# Altium schematic sheet NNLightSwitcher_WirelessCharger.SchDoc
size A4
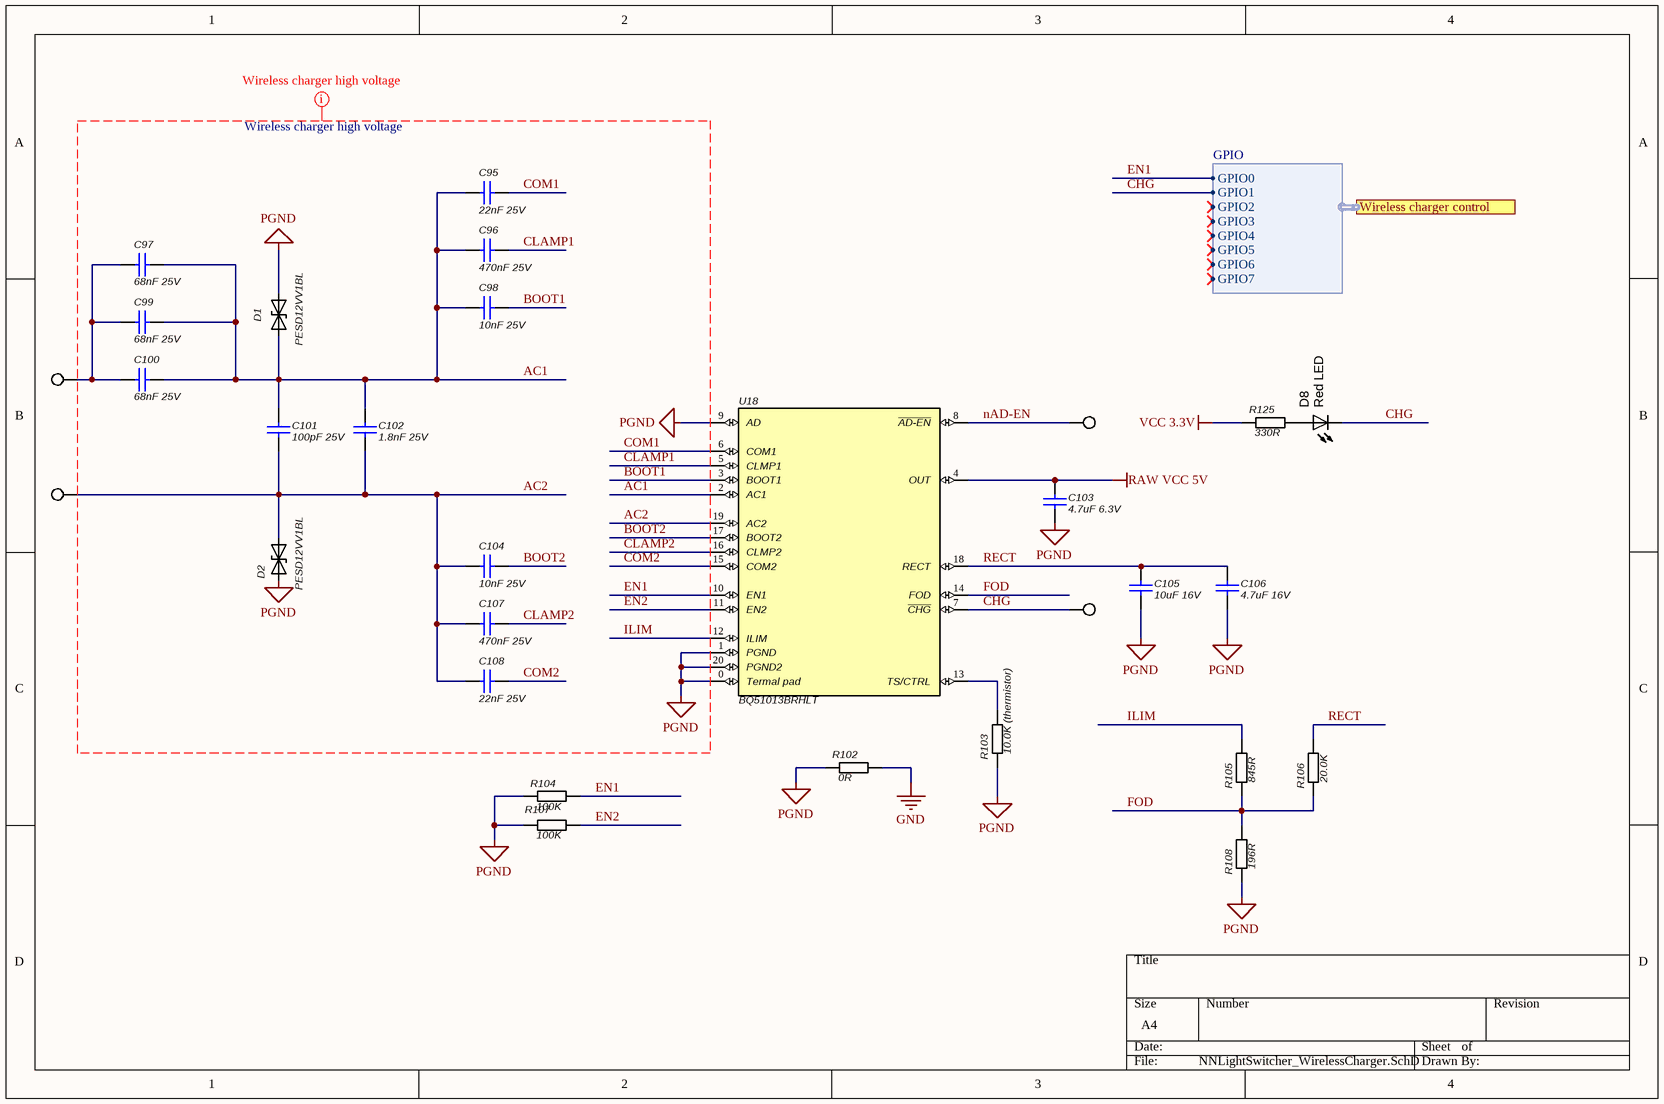
[diagram p0: NNLightSwitcher_WirelessCharger.SchDoc]

## Parts
C95  22nF 25V  [0402]
C96  470nF 25V  [0402]
C97  68nF 25V  [*0603]
C98  10nF 25V  [0402]
C99  68nF 25V  [*0603]
C100  68nF 25V  [*0603]
C101  100pF 25V  [0402]
C102  1.8nF 25V  [0402]
C103  4.7uF 6.3V  [*0603]
C104  10nF 25V  [0402]
C105  10uF 16V  [*0603]
C106  4.7uF 16V  [*0603]
C107  470nF 25V  [0402]
C108  22nF 25V  [0402]
D1  PESD12VV1BL  [*SOD882(T)]
D2  PESD12VV1BL  [*SOD882(T)]
D8  Red LED  [*LED_SML-P11UTT86R_SML-P11MTT86(Primary)]
R102  0R  [0402]
R103  10.0K (thermistor)  [0402]
R104  100K  [0402]
R105  845R  [0402]
R106  20.0K  [0402]
R107  100K  [0402]
R108  196R  [0402]
R125  330R  [0402]
TP56  Test point  [Connection]  (value not drawn)
TP57  Test point  [Testpoint_with_pad]  (value not drawn)
TP58  Test point  [Connection]  (value not drawn)
TP59  Test point  [Testpoint_Keystone_Miniature]  (value not drawn)
U18  BQ51013BRHLT  [*QFN-20(VQFN-20)]

## Ports
Wireless charger control (harness GPIO)

## Harnesses
GPIO: GPIO7, GPIO6, GPIO5, GPIO4, GPIO3, GPIO2, GPIO1, GPIO0

## Nets
GND: R102.2
PGND: C103.2 C105.1 C106.2 D1.1(K) D2.2(A) R102.1 R103.1 R104.1 R107.1 R108.1 U18.0(Termal_pad) U18.1(PGND) U18.9(AD) U18.20(PGND2)
RAW VCC 5V: C103.1 U18.4(OUT)
VCC 3.3V: R125.1
AC1: C95.2 C96.2 C97.1 C98.2 C99.1 C100.1 C101.1 C102.1 D1.2(A) U18.2(AC1)
AC2: C101.2 C102.2 C104.2 C107.2 C108.2 D2.1(K) TP58.1 U18.19(AC2)
BOOT1: C98.1 U18.3(BOOT1)
BOOT2: C104.1 U18.17(BOOT2)
CHG: D8.C TP59.1 U18.7(~{CHG}) ; port Wireless charger control.GPIO1
CLAMP1: C96.1 U18.5(CLMP1)
CLAMP2: C107.1 U18.16(CLMP2)
COM1: C95.1 U18.6(COM1)
COM2: C108.1 U18.15(COM2)
EN1: R104.2 U18.10(EN1) ; port Wireless charger control.GPIO0
EN2: R107.2 U18.11(EN2)
FOD: R105.1 R106.1 R108.2 U18.14(FOD)
ILIM: R105.2 U18.12(ILIM)
nAD-EN: TP57.1 U18.8(~{AD-EN})
RECT: C105.2 C106.1 R106.2 U18.18(RECT)
NetC97_2: C97.2 C99.2 C100.2 TP56.1
NetD8_A: D8.A R125.2
NetR103_2: R103.2 U18.13(TS/CTRL)

## Layout directives
net class Wireless charger high voltage: AC1, AC2, BOOT1, BOOT2, CLAMP1, CLAMP2, COM1, COM2, EN1, EN2, ILIM, PGND

## Library data of the parts
C95 C108 = Capacitor 22nF 25V: GRM155R71E223KA61D; Manufacturer 1: Murata; Tolerance: 10%; Dielectric: X7R; ComponentLink1Description: Datasheet link; ComponentLink1URL: http://www.yageo.com/documents/recent/UPY-GP_NP0_16V-to-50V_16.pdf; Supplier 1: Digi-Key; Manufacturer Part Number 1: GRM155R71E223KA61D; Stock 1: 876310; Pricing 1: 1=0,10000, 10=0,05300, 100=0,02370, 500=0,01690, 1000=0,01328, 2500=0,01208, 5000=0,01111 (USD); RoHS: Yes; Mount: Surface Mount; Case/Package: 0402; Case Code (Metric): 1005; Case Code (Imperial): 0402; Min Operating Temperature: -55°C; Max Operating Temperature: 125°C; Capacitance: 22nF; Packaging: Tape and Reel; Package Quantity: 1; Voltage Rating: 25V; Termination: SMD/SMT; Voltage: 25V; Voltage Rating (DC): 25V; Length: 1mm; Height: 0.5mm; Width: 0.02inch; Thickness: 0.022inch; Depth: 0.5mm; Radiation Hardening: No; REACH SVHC: No SVHC; Lead Free: Lead Free; ComponentLink2URL: https://datasheet.ciiva.com/131/product-131108.pdf?src-supplier=Digi-Key; ComponentLink2Description: https://datasheet.ciiva.com/131/product-131108.pdf?src-supplier=Digi-Key; ComponentLink3URL: https://datasheet.ciiva.com/131/grm155r71e223ka61-01-131110.pdf?src-supplier=Digi-Key; ComponentLink3Description: https://datasheet.ciiva.com/131/grm155r71e223ka61-01-131110.pdf?src-supplier=Digi-Key; ComponentLink4URL: https://datasheet.ciiva.com/18184/getdatasheetpartid-178879-18184701.pdf?src-supplier=Verical; ComponentLink4Description: https://datasheet.ciiva.com/18184/getdatasheetpartid-178879-18184701.pdf?src-supplier=Verical; ComponentLink5URL: https://datasheet.ciiva.com/14103/grmseries-highdielectrictype-eng-14103752.pdf?src-supplier=Distrelec; ComponentLink5Description: https://datasheet.ciiva.com/14103/grmseries-highdielectrictype-eng-14103752.pdf?src-supplier=Distrelec; ComponentLink6URL: https://datasheet.ciiva.com/5414/product-5414091.pdf?src-supplier=Mouser; ComponentLink6Description: https://datasheet.ciiva.com/5414/product-5414091.pdf?src-supplier=Mouser; ComponentLink7URL: https://datasheet.ciiva.com/16396/product-16396813.pdf?src-supplier=Future+Electronics; ComponentLink7Description: https://datasheet.ciiva.com/16396/product-16396813.pdf?src-supplier=Future+Electronics; ComponentLink8URL: https://datasheet.ciiva.com/2989/product-2989390.pdf?src-supplier=Avnet; ComponentLink8Description: https://datasheet.ciiva.com/2989/product-2989390.pdf?src-supplier=Avnet
C96 C107 = Capacitor 470nF 25V: GRM188R71E474KA12D; Manufacturer 1: Murata; Material: Ceramic; Tolerance: 10%; Dielectric: X7R; Voltage: 50V; ComponentLink1Description: Datasheet link; ComponentLink1URL: http://www.yageo.com/documents/recent/UPY-GP_NP0_16V-to-50V_16.pdf; Supplier 1: Digi-Key; Manufacturer Part Number 1: GRM188R71E474KA12D; Stock 1: 3228065; Pricing 1: 1=0,25000, 10=0,16800, 100=0,08520, 500=0,05832, 1000=0,05159 (USD); RoHS: Yes; Mount: Surface Mount; Case/Package: 0603; Number of Pins: 2; Case Code (Metric): 1608; Case Code (Imperial): 0603; Min Operating Temperature: -55°C; Max Operating Temperature: 125°C; Capacitance: 470nF; Packaging: Tape and Reel; Voltage Rating: 25V; Package Quantity: 4000; Voltage Rating (DC): 25V; Termination: SMD/SMT; Length: 1.6mm; Height: 0.8mm; Width: 0.031inch; Thickness: 0.035inch; Depth: 0.8mm; REACH SVHC: No SVHC; Lead Free: Lead Free; ComponentLink2URL: https://datasheet.ciiva.com/16293/grm188r71e474ka12d-16293088.pdf?src-supplier=Future+Electronics; ComponentLink2Description: https://datasheet.ciiva.com/16293/grm188r71e474ka12d-16293088.pdf?src-supplier=Future+Electronics; ComponentLink3URL: https://datasheet.ciiva.com/34302/1857559-34302862.pdf?src-supplier=Jameco; ComponentLink3Description: https://datasheet.ciiva.com/34302/1857559-34302862.pdf?src-supplier=Jameco; ComponentLink4URL: https://datasheet.ciiva.com/7937/1747458-7937650.pdf?src-supplier=Element14; ComponentLink4Description: https://datasheet.ciiva.com/7937/1747458-7937650.pdf?src-supplier=Element14; ComponentLink5URL: https://datasheet.ciiva.com/134/grm188r71e474ka12-01-134310.pdf?src-supplier=Digi-Key; ComponentLink5Description: https://datasheet.ciiva.com/134/grm188r71e474ka12-01-134310.pdf?src-supplier=Digi-Key; ComponentLink6URL: https://datasheet.ciiva.com/29199/454518-da-01-en-vs-kondensator-0603-29199596.pdf?src-supplier=Conrad; ComponentLink6Description: https://datasheet.ciiva.com/29199/454518-da-01-en-vs-kondensator-0603-29199596.pdf?src-supplier=Conrad; ComponentLink7URL: https://datasheet.ciiva.com/22703/1747458-22703340.pdf?src-supplier=Element14; ComponentLink7Description: https://datasheet.ciiva.com/22703/1747458-22703340.pdf?src-supplier=Element14; ComponentLink8URL: https://datasheet.ciiva.com/134/grm188r71e474ka12-01-134309.pdf?src-supplier=Digi-Key; ComponentLink8Description: https://datasheet.ciiva.com/134/grm188r71e474ka12-01-134309.pdf?src-supplier=Digi-Key; ComponentLink9URL: https://datasheet.ciiva.com/134/grm188r71e474ka12-01-134308.pdf?src-supplier=Digi-Key; ComponentLink9Description: https://datasheet.ciiva.com/134/grm188r71e474ka12-01-134308.pdf?src-supplier=Digi-Key
C97 C99 C100 = Capacitor 68nF 25V: CAP CER 0.068UF 25V X7R 0603CC0603KRX7R8BB683; Manufacturer 1: Yageo; Tolerance: 10%; ComponentLink1Description: Datasheet link; ComponentLink1URL: http://www.yageo.com/documents/recent/UPY-GP_NP0_16V-to-50V_16.pdf; Supplier 1: Digi-Key; Manufacturer Part Number 1: CC0603KRX7R8BB683; Stock 1: 55162; Pricing 1: 1=0,11000, 10=0,08400, 100=0,03740, 500=0,02672, 1000=0,02099 (USD); RoHS: Yes; Mount: Surface Mount; Case/Package: 0603; Number of Pins: 2; Weight: 7.1E-05oz; Case Code (Imperial): 0603; Case Code (Metric): 1608; Min Operating Temperature: -55°C; Max Operating Temperature: 125°C; Capacitance: 68nF; Dielectric: X7R; Voltage Rating: 25V; Voltage Rating (DC): 25V; Packaging: Tape and Reel; Termination: SMD/SMT; Composition: Ceramic; Voltage: 25V; Length: 1.6mm; Height: 0.8mm; Width: 0.8mm; Thickness: 0.035inch; Depth: 0.8mm; Radiation Hardening: No; Lead Free: Lead Free; Halogen Free: Halogen Free; ComponentLink2URL: https://datasheet.ciiva.com/11786/0900766b80c10176-11786209.pdf?src-supplier=RSComponents; ComponentLink2Description: https://datasheet.ciiva.com/11786/0900766b80c10176-11786209.pdf?src-supplier=RSComponents; ComponentLink3URL: https://datasheet.ciiva.com/26862/getdatasheetpartid-403581-26862844.pdf?src-supplier=Verical; ComponentLink3Description: https://datasheet.ciiva.com/26862/getdatasheetpartid-403581-26862844.pdf?src-supplier=Verical; ComponentLink4URL: https://datasheet.ciiva.com/11465/upy-gphc-x7r-6-3v-to-50v-8-11465211.pdf?src-supplier=Avnet; ComponentLink4Description: https://datasheet.ciiva.com/11465/upy-gphc-x7r-6-3v-to-50v-8-11465211.pdf?src-supplier=Avnet; ComponentLink5URL: https://datasheet.ciiva.com/17434/upy-gphc-x7r-6-3v-to-50v-8-17434638.pdf?src-supplier=Avnet+Europe; ComponentLink5Description: https://datasheet.ciiva.com/17434/upy-gphc-x7r-6-3v-to-50v-8-17434638.pdf?src-supplier=Avnet+Europe
C98 C104 = Capacitor 10nF 25V: GRM155R71E103KA01D; Manufacturer 1: Murata; Material: Ceramic; Tolerance: 10%; Dielectric: X7R; Insulation Resistance: 10GR; ComponentLink1Description: Datasheet link; ComponentLink1URL: http://www.yageo.com/documents/recent/UPY-GP_NP0_16V-to-50V_16.pdf; Supplier 1: Digi-Key; Manufacturer Part Number 1: GRM155R71E103KA01D; Stock 1: 8764399; Pricing 1: 1=0,10000, 10=0,02900, 100=0,01300, 500=0,00928, 1000=0,00729, 2500=0,00662, 5000=0,00610 (USD); RoHS: Yes; Mount: Surface Mount; Case/Package: 0402; Number of Pins: 2; Case Code (Imperial): 0402; Case Code (Metric): 1005; Dielectric Material: Ceramic; Min Operating Temperature: -55°C; Max Operating Temperature: 125°C; Capacitance: 10nF; Packaging: Tape and Reel; Voltage Rating: 25V; Voltage Rating (DC): 25V; Package Quantity: 1; Termination: SMD/SMT; Voltage: 25V; Length: 1mm; Height: 0.5mm; Width: 0.5mm; Thickness: 0.022inch; Depth: 0.5mm; Radiation Hardening: No; REACH SVHC: No SVHC; Lead Free: Lead Free; ComponentLink2URL: https://datasheet.ciiva.com/11786/0900766b807a1cab-11786320.pdf?src-supplier=RSComponents; ComponentLink2Description: https://datasheet.ciiva.com/11786/0900766b807a1cab-11786320.pdf?src-supplier=RSComponents; ComponentLink3URL: https://datasheet.ciiva.com/18184/getdatasheetpartid-161489-18184689.pdf?src-supplier=Verical; ComponentLink3Description: https://datasheet.ciiva.com/18184/getdatasheetpartid-161489-18184689.pdf?src-supplier=Verical; ComponentLink4URL: https://datasheet.ciiva.com/28534/1699889-28534148.pdf?src-supplier=Element14; ComponentLink4Description: https://datasheet.ciiva.com/28534/1699889-28534148.pdf?src-supplier=Element14; ComponentLink5URL: https://datasheet.ciiva.com/3777/3813grm155r71e103ka0123-3777115.pdf?src-supplier=Arrow; ComponentLink5Description: https://datasheet.ciiva.com/3777/3813grm155r71e103ka0123-3777115.pdf?src-supplier=Arrow; ComponentLink6URL: https://datasheet.ciiva.com/129/partnumbering-e-01-129741.pdf?src-supplier=Digi-Key; ComponentLink6Description: https://datasheet.ciiva.com/129/partnumbering-e-01-129741.pdf?src-supplier=Digi-Key; ComponentLink7URL: https://datasheet.ciiva.com/129/partnumbering-e-01-129742.pdf?src-supplier=Digi-Key; ComponentLink7Description: https://datasheet.ciiva.com/129/partnumbering-e-01-129742.pdf?src-supplier=Digi-Key; ComponentLink8URL: https://datasheet.ciiva.com/129/partnumbering-e-01-129743.pdf?src-supplier=Digi-Key; ComponentLink8Description: https://datasheet.ciiva.com/129/partnumbering-e-01-129743.pdf?src-supplier=Digi-Key; ComponentLink9URL: https://datasheet.ciiva.com/29199/454154-da-01-en-vs-kondensator-0402-29199817.pdf?src-supplier=Conrad; ComponentLink9Description: https://datasheet.ciiva.com/29199/454154-da-01-en-vs-kondensator-0402-29199817.pdf?src-supplier=Conrad; ComponentLink10URL: https://datasheet.ciiva.com/7937/1747448-7937621.pdf?src-supplier=Element14; ComponentLink10Description: https://datasheet.ciiva.com/7937/1747448-7937621.pdf?src-supplier=Element14; ComponentLink11URL: https://datasheet.ciiva.com/16199/product-16199034.pdf?src-supplier=Future+Electronics; ComponentLink11Description: https://datasheet.ciiva.com/16199/product-16199034.pdf?src-supplier=Future+Electronics
C101 = Capacitor 100pF 25V: GRM033R71E101KA01D; Manufacturer 1: Murata; Material: Ceramic; Tolerance: 10%; Dielectric: X7R; ComponentLink1Description: Datasheet link; ComponentLink1URL: http://www.yageo.com/documents/recent/UPY-GP_NP0_16V-to-50V_16.pdf; Supplier 1: Digi-Key; Manufacturer Part Number 1: GRM033R71E101KA01D; Stock 1: 726781; Pricing 1: 1=0,10000, 10=0,02700, 100=0,01190, 500=0,00848, 1000=0,00666, 2500=0,00605, 5000=0,00557 (USD); RoHS: Yes; Mount: Surface Mount; Case/Package: 0201; Case Code (Imperial): 0201; Case Code (Metric): 0603; Min Operating Temperature: -55°C; Max Operating Temperature: 125°C; Capacitance: 100pF; Packaging: Tape and Reel; Voltage Rating: 25V; Voltage Rating (DC): 25V; Package Quantity: 1; Termination: SMD/SMT; Voltage: 25V; Length: 0.6mm; Height: 0.3mm; Width: 0.3mm; Thickness: 0.013inch; Depth: 0.3mm; Radiation Hardening: No; Lead Free: Lead Free; ComponentLink2URL: https://datasheet.ciiva.com/18184/getdatasheetpartid-228478-18184102.pdf?src-supplier=Verical; ComponentLink2Description: https://datasheet.ciiva.com/18184/getdatasheetpartid-228478-18184102.pdf?src-supplier=Verical; ComponentLink3URL: https://datasheet.ciiva.com/129/grm033r71e101ka01-01-129915.pdf?src-supplier=Digi-Key; ComponentLink3Description: https://datasheet.ciiva.com/129/grm033r71e101ka01-01-129915.pdf?src-supplier=Digi-Key; ComponentLink4URL: https://datasheet.ciiva.com/129/grm033r71e101ka01-01-129916.pdf?src-supplier=Digi-Key; ComponentLink4Description: https://datasheet.ciiva.com/129/grm033r71e101ka01-01-129916.pdf?src-supplier=Digi-Key; ComponentLink5URL: https://datasheet.ciiva.com/129/grm033r71e101ka01-01-129917.pdf?src-supplier=Digi-Key; ComponentLink5Description: https://datasheet.ciiva.com/129/grm033r71e101ka01-01-129917.pdf?src-supplier=Digi-Key; ComponentLink6URL: https://datasheet.ciiva.com/29199/455792-da-01-en-vs-kondensator-0201-29199171.pdf?src-supplier=Conrad; ComponentLink6Description: https://datasheet.ciiva.com/29199/455792-da-01-en-vs-kondensator-0201-29199171.pdf?src-supplier=Conrad; ComponentLink7URL: https://datasheet.ciiva.com/11605/product-11605541.pdf?src-supplier=Avnet; ComponentLink7Description: https://datasheet.ciiva.com/11605/product-11605541.pdf?src-supplier=Avnet; ComponentLink8URL: https://datasheet.ciiva.com/16370/product-16370826.pdf?src-supplier=Future+Electronics; ComponentLink8Description: https://datasheet.ciiva.com/16370/product-16370826.pdf?src-supplier=Future+Electronics
C102 = Capacitor 1.8nF 50V: GRM155R71H182KA01D; Manufacturer 1: Murata; Material: Ceramic; Tolerance: 10%; Dielectric: X7R; Voltage Rating: 50V; ComponentLink1Description: Datasheet link; ComponentLink1URL: http://www.yageo.com/documents/recent/UPY-GP_NP0_16V-to-50V_16.pdf; Supplier 1: Digi-Key; Manufacturer Part Number 1: GRM155R71H182KA01D; Stock 1: 1524; Pricing 1: 1=0,10000, 10=0,02900, 100=0,01300, 500=0,00928, 1000=0,00729, 2500=0,00662, 5000=0,00610 (USD); RoHS: Yes; Mount: Surface Mount; Case/Package: 0402; Case Code (Metric): 1005; Case Code (Imperial): 0402; Min Operating Temperature: -55°C; Max Operating Temperature: 125°C; Capacitance: 1.8nF; Package Quantity: 1; Packaging: Tape and Reel; Voltage Rating (DC): 50V; Termination: SMD/SMT; Voltage: 50V; Length: 1mm; Height: 0.5mm; Width: 0.5mm; Thickness: 0.022inch; Depth: 0.5mm; Radiation Hardening: No; REACH SVHC: No SVHC; Lead Free: Lead Free; ComponentLink2URL: https://datasheet.ciiva.com/18184/getdatasheetpartid-199954-18184733.pdf?src-supplier=Verical; ComponentLink2Description: https://datasheet.ciiva.com/18184/getdatasheetpartid-199954-18184733.pdf?src-supplier=Verical; ComponentLink3URL: https://datasheet.ciiva.com/161/partnumbering-e-01-161462.pdf?src-supplier=Digi-Key; ComponentLink3Description: https://datasheet.ciiva.com/161/partnumbering-e-01-161462.pdf?src-supplier=Digi-Key; ComponentLink4URL: https://datasheet.ciiva.com/161/partnumbering-e-01-161463.pdf?src-supplier=Digi-Key; ComponentLink4Description: https://datasheet.ciiva.com/161/partnumbering-e-01-161463.pdf?src-supplier=Digi-Key; ComponentLink5URL: https://datasheet.ciiva.com/161/partnumbering-e-01-161464.pdf?src-supplier=Digi-Key; ComponentLink5Description: https://datasheet.ciiva.com/161/partnumbering-e-01-161464.pdf?src-supplier=Digi-Key; ComponentLink6URL: https://datasheet.ciiva.com/2989/product-2989404.pdf?src-supplier=Avnet; ComponentLink6Description: https://datasheet.ciiva.com/2989/product-2989404.pdf?src-supplier=Avnet; ComponentLink7URL: https://datasheet.ciiva.com/5422/product-5422047.pdf?src-supplier=Mouser; ComponentLink7Description: https://datasheet.ciiva.com/5422/product-5422047.pdf?src-supplier=Mouser
C103 = Capacitor 4.7uF 6.3V: ComponentLink1Description: Datasheet link; ComponentLink1URL: http://www.yageo.com/documents/recent/UPY-GP_NP0_16V-to-50V_16.pdf
C105 = Capacitor 10uF 16V: EMK107BBJ106MA-T; Manufacturer 1: Taiyo Yuden; Tolerance: 20%; Dielectric: X5R; ComponentLink1Description: Datasheet link; ComponentLink1URL: http://www.yageo.com/documents/recent/UPY-GP_NP0_16V-to-50V_16.pdf; Supplier 1: Digi-Key; Manufacturer Part Number 1: EMK107BBJ106MA-T; Stock 1: 576511; Pricing 1: 1=0,44000, 10=0,30600, 100=0,18370, 500=0,13778, 1000=0,11635 (USD); RoHS: Yes; Mount: Surface Mount; Case/Package: 0603; Case Code (Metric): 1608; Case Code (Imperial): 0603; Min Operating Temperature: -55°C; Max Operating Temperature: 85°C; Capacitance: 10uF; Packaging: Tape and Reel; Voltage Rating: 16V; Package Quantity: 1; Termination: SMD/SMT; Voltage Rating (DC): 16V; Length: 0.063inch; Height: 0.8mm; Width: 0.031inch; Thickness: 0.031inch; REACH SVHC: Unknown; Halogen Free: Halogen Free; ComponentLink2URL: https://datasheet.ciiva.com/6259/emk107bbj106ma-t-6259169.pdf?src-supplier=Digi-Key; ComponentLink2Description: https://datasheet.ciiva.com/6259/emk107bbj106ma-t-6259169.pdf?src-supplier=Digi-Key; ComponentLink3URL: https://datasheet.ciiva.com/15920/3emk107bbj106ma-t-15920482.pdf?src-supplier=Onlinecomponents.com; ComponentLink3Description: https://datasheet.ciiva.com/15920/3emk107bbj106ma-t-15920482.pdf?src-supplier=Onlinecomponents.com; ComponentLink4URL: https://datasheet.ciiva.com/34372/463emk107bbj106ma-t-34372674.pdf?src-supplier=Onlinecomponents.com; ComponentLink4Description: https://datasheet.ciiva.com/34372/463emk107bbj106ma-t-34372674.pdf?src-supplier=Onlinecomponents.com; ComponentLink5URL: https://datasheet.ciiva.com/6259/emk107bbj106ma-t-6259164.pdf?src-supplier=Digi-Key; ComponentLink5Description: https://datasheet.ciiva.com/6259/emk107bbj106ma-t-6259164.pdf?src-supplier=Digi-Key; ComponentLink6URL: https://datasheet.ciiva.com/6259/emk107bbj106ma-t-6259167.pdf?src-supplier=Digi-Key; ComponentLink6Description: https://datasheet.ciiva.com/6259/emk107bbj106ma-t-6259167.pdf?src-supplier=Digi-Key; ComponentLink7URL: https://datasheet.ciiva.com/13168/mlcc01-e-13168735.pdf?src-supplier=Mouser; ComponentLink7Description: https://datasheet.ciiva.com/13168/mlcc01-e-13168735.pdf?src-supplier=Mouser
C106 = Capacitor 4.7uF 16V: GRM188R61C475KAAJ; Manufacturer 1: Murata; Manufacturer Part Number 1: GRM188R61C475KAAJD; Material: Ceramic; Tolerance: 10%; Dielectric: X5R; ComponentLink1Description: Datasheet link; ComponentLink1URL: http://www.yageo.com/documents/recent/UPY-GP_NP0_16V-to-50V_16.pdf; Supplier 1: Digi-Key; Stock 1: 258279; Pricing 1: 1=0,35000, 10=0,24600, 100=0,14730, 500=0,11050, 1000=0,09331 (USD); RoHS: Yes; Mount: Surface Mount; Case/Package: 0603; Weight: 0.000222oz; Case Code (Metric): 1608; Case Code (Imperial): 0603; Min Operating Temperature: -55°C; Max Operating Temperature: 85°C; Capacitance: 4.7uF; Voltage Rating (DC): 16V; Packaging: Tape and Reel; Voltage Rating: 16V; Termination: SMD/SMT; Package Quantity: 4000; Length: 1.6mm; Height: 0.8mm; Width: 0.8mm; Thickness: 0.037inch; Depth: 0.8mm; REACH SVHC: No SVHC; Lead Free: Lead Free; ComponentLink2URL: https://datasheet.ciiva.com/14813/595grm188r61c475kaaj23-14813668.pdf?src-supplier=Arrow; ComponentLink2Description: https://datasheet.ciiva.com/14813/595grm188r61c475kaaj23-14813668.pdf?src-supplier=Arrow
D1 D2 = PESD12VV1BL: ESD Suppressor TVS 30KV; Manufacturer 1: Nexperia; Manufacturer Part Number 1: PESD12VV1BL,315; Value: *; ComponentLink1Description: https://assets.nexperia.com/documents/data-sheet/PESD12VV1BL.pdf?src-supplier=Digi-Key; ComponentLink1URL: https://assets.nexperia.com/documents/data-sheet/PESD12VV1BL.pdf?src-supplier=Digi-Key; Manufacturer 2: Nexperia; Manufacturer Part Number 2: PESD12VV1BL,315; Pricing 1: 1=0,38000, 10=0,30400, 100=0,20730, 500=0,15548, 1000=0,11661 (USD); Pricing 2: 1=0,48000, 10=0,34000, 50=0,34000, 100=0,15600, 1000=0,12000, 2500=0,10200, 10000=0,09300, 20000=0,08700, 50000=0,07800, 100000=0,07500 (USD); RoHS: No; Stock 1: 45449; Stock 2: 157674; Supplier 1: Digi-Key; Supplier 2: Mouser; Supplier Part Number 1: 1727-1304-1-ND; Supplier Part Number 2: 771-PESD12VV1BL,315
D8 = APHHS1005SURCK: LED red 0402; Manufacturer 1: Kingbright; Lens Color: Clear; Forward Current: 20mA; Forward Voltage: 1.95V; Luminous Intensity: 220mcd; Viewing Angle: 120°; Lens Style: Clear,Flat; Dominant Wavelength: 630nm; Number of LEDs: 1; Wavelength: 635nm; ComponentLink1URL: https://datasheet.ciiva.com/15198/getdatasheetpartid-569583-15198505.pdf?src-supplier=Verical; ComponentLink1Description: https://datasheet.ciiva.com/15198/getdatasheetpartid-569583-15198505.pdf?src-supplier=Verical; Supplier 1: Digi-Key; Manufacturer Part Number 1: APHHS1005SURCK; Stock 1: 30423; Pricing 1: 1=0,42000, 10=0,30400, 100=0,19820, 500=0,14248, 1000=0,11151 (USD); RoHS: Yes; Mount: Surface Mount; Case/Package: 0402; Number of Pins: 2; Color: Red; Case Code (Metric): 1005; Case Code (Imperial): 0402; Min Operating Temperature: -40°C; Max Operating Temperature: 85°C; Illumination Color: Red; Packaging: Tape and Reel; Package Quantity: 2000; Test Current: 20mA; Length: 1mm; Height: 0.6mm; Width: 0.5mm; Lead Free: Lead Free; ComponentLink2URL: https://datasheet.ciiva.com/2114/aphhs1005surck-2114140.pdf?src-supplier=Digi-Key; ComponentLink2Description: https://datasheet.ciiva.com/2114/aphhs1005surck-2114140.pdf?src-supplier=Digi-Key; ComponentLink3URL: https://datasheet.ciiva.com/4689/aphhs1005surck-32322-4689068.pdf?src-supplier=Mouser; ComponentLink3Description: https://datasheet.ciiva.com/4689/aphhs1005surck-32322-4689068.pdf?src-supplier=Mouser; ComponentLink4URL: https://datasheet.ciiva.com/14603/70062833-14603899.pdf?src-supplier=Allied+Electronics; ComponentLink4Description: https://datasheet.ciiva.com/14603/70062833-14603899.pdf?src-supplier=Allied+Electronics; ComponentLink5URL: https://datasheet.ciiva.com/2114/aphhs1005surck-2114141.pdf?src-supplier=Digi-Key; ComponentLink5Description: https://datasheet.ciiva.com/2114/aphhs1005surck-2114141.pdf?src-supplier=Digi-Key; ComponentLink6URL: https://datasheet.ciiva.com/2114/aphhs1005surck-2114142.pdf?src-supplier=Digi-Key; ComponentLink6Description: https://datasheet.ciiva.com/2114/aphhs1005surck-2114142.pdf?src-supplier=Digi-Key
R102 = Resistor 0R
R103 = Resistor 10.0K: thermistor
R104 R107 = Resistor 100K
R105 = Resistor 845R
R106 = Resistor 20.0K
R108 = Resistor 196R
R125 = Resistor 330R
TP56-TP59 = Test point: Test Point, Miniature, SMT; ComponentLink1Description: Datasheet URL; ComponentLink1URL: http://www.keyelco.com/userAssets/store/files/5015.PDF
U18 = BQ51013BRHLT: WPC 1.1 Compatible Fully Integrated Wireless Power Receiver IC 20-VQFN; Manufacturer 1: Texas Instruments; Operating Supply Current: 8mA; Output Current: 1.5A; Output Voltage: 5V; Min Supply Voltage: 4V; Max Supply Voltage: 10V; Output Power: 5W; Supplier 1: Digi-Key; Stock 1: 2807; Pricing 1: 1=4,02000, 10=3,58800, 25=3,22960, 100=2,94250 (USD); RoHS: Yes; Mount: Surface Mount; Case/Package: VQFN; Number of Pins: 20; Weight: 0.002469oz; Contact Plating: Gold; Min Operating Temperature: -40°C; Max Operating Temperature: 150°C; Packaging: Tape and Reel; Package Quantity: 250; Logic Function: Receiver; Length: 4.65mm; Height: 0.95mm; Width: 3.65mm; Lead Free: Lead Free; REACH SVHC: No SVHC; ComponentLink1URL: https://datasheet.ciiva.com/22691/1726308-22691764.pdf?src-supplier=Element14; ComponentLink1Description: https://datasheet.ciiva.com/22691/1726308-22691764.pdf?src-supplier=Element14; ComponentLink2URL: https://datasheet.ciiva.com/6602/bq51013b-6602581.pdf?src-supplier=Digi-Key; ComponentLink2Description: https://datasheet.ciiva.com/6602/bq51013b-6602581.pdf?src-supplier=Digi-Key; ComponentLink3URL: https://datasheet.ciiva.com/6602/bq51013b-6602582.pdf?src-supplier=Digi-Key; ComponentLink3Description: https://datasheet.ciiva.com/6602/bq51013b-6602582.pdf?src-supplier=Digi-Key; ComponentLink4URL: https://datasheet.ciiva.com/6602/bq51013b-6602583.pdf?src-supplier=Digi-Key; ComponentLink4Description: https://datasheet.ciiva.com/6602/bq51013b-6602583.pdf?src-supplier=Digi-Key; Manufacturer Part Number 1: BQ51013BRHLT